# Altium schematic sheet AllInOne.SchDoc
size A4
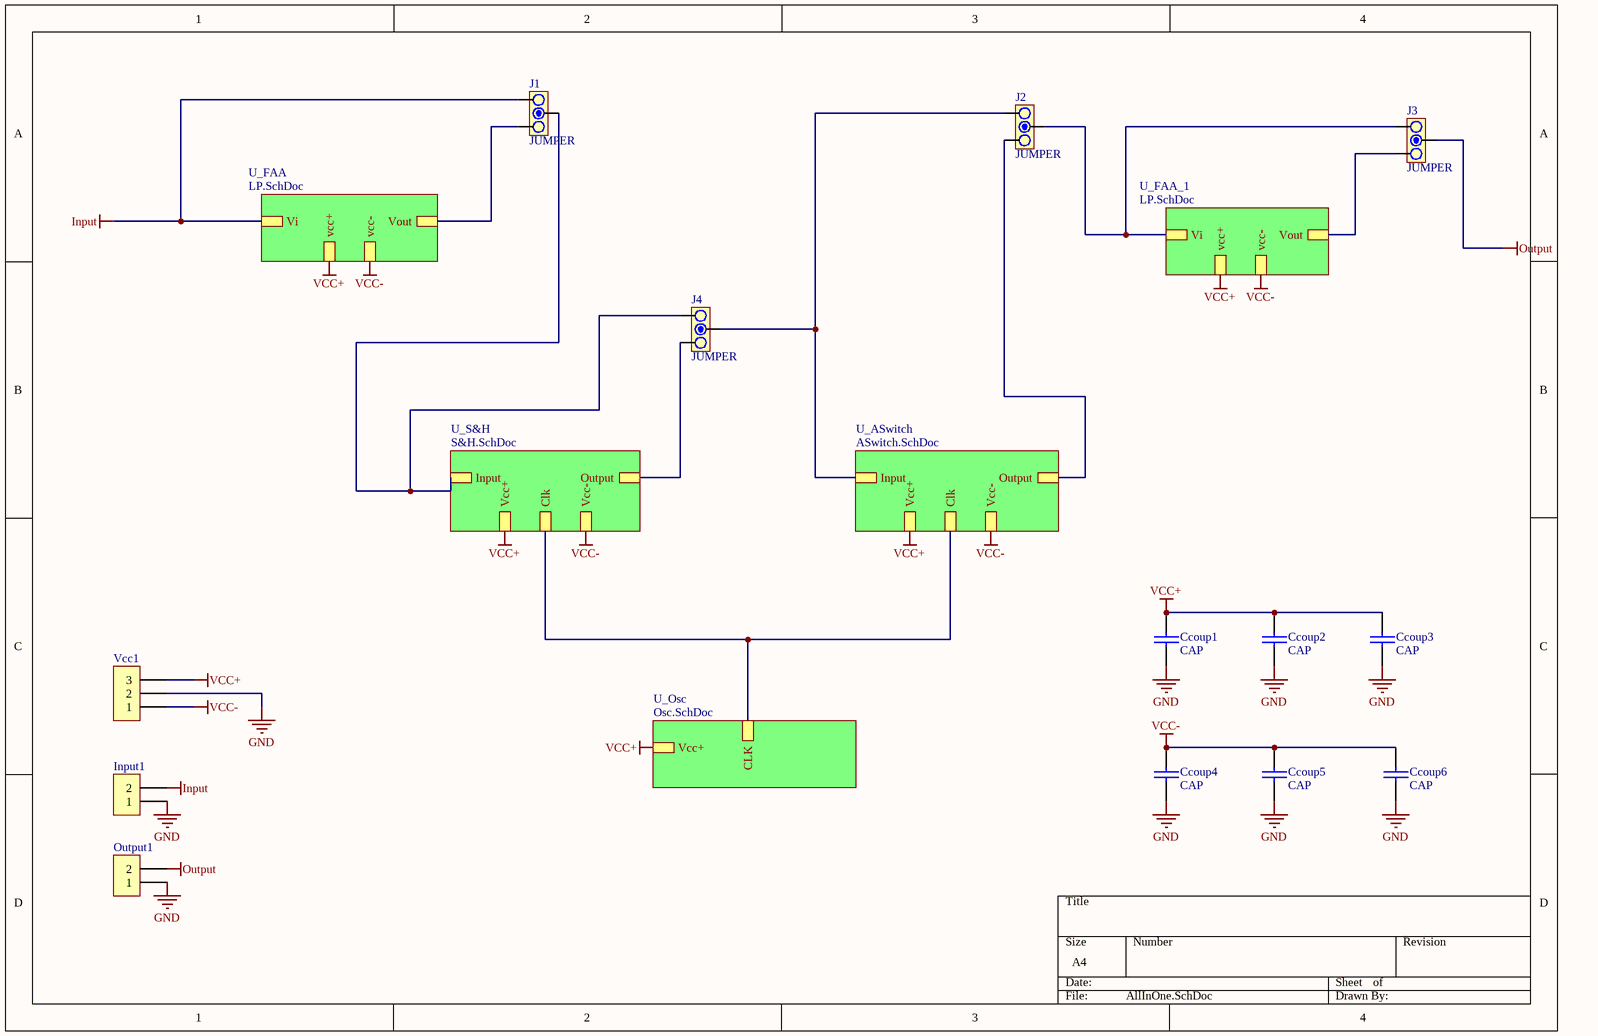
[diagram p0: AllInOne.SchDoc]

## Parts
Ccoup1  CAP  [0805]
Ccoup2  CAP  [0805]
Ccoup3  CAP  [0805]
Ccoup4  CAP  [0805]
Ccoup5  CAP  [0805]
Ccoup6  CAP  [0805]
Input1  BORNERA 2  [BORNERA2]  (value not drawn)
J1  JUMPER  [JUMPER3]
J2  JUMPER  [JUMPER3]
J3  JUMPER  [JUMPER3]
J4  JUMPER  [JUMPER3]
Output1  BORNERA 2  [BORNERA2]  (value not drawn)
Vcc1  BORNERA 3  [BORNERA3]  (value not drawn)

## Sub-sheets
U_ASwitch = ASwitch.SchDoc: Input, Output, Vcc+, Vcc-, Clk
U_FAA = LP.SchDoc: vcc+, vcc-, Vi, Vout
U_FAA_1 = LP.SchDoc: vcc+, vcc-, Vi, Vout
U_Osc = Osc.SchDoc: CLK, Vcc+
U_S&H = S&H.SchDoc: Output, Input, Vcc+, Clk, Vcc-

## Nets
GND: Ccoup1.2 Ccoup2.2 Ccoup3.2 Ccoup4.2 Ccoup5.2 Ccoup6.2 Input1.1 Output1.1 Vcc1.2
Input: Input1.2 J1.3 ; sheet U_FAA/Vi
Output: J3.2 Output1.2
VCC+: Ccoup1.1 Ccoup2.1 Ccoup3.1 Vcc1.3 ; sheet U_FAA/vcc+, sheet U_FAA_1/vcc+, sheet U_S&H/Vcc+, sheet U_ASwitch/Vcc+, sheet U_Osc/Vcc+
VCC-: Ccoup4.1 Ccoup5.1 Ccoup6.1 Vcc1.1 ; sheet U_FAA/vcc-, sheet U_FAA_1/vcc-, sheet U_S&H/Vcc-, sheet U_ASwitch/Vcc-
NetJ1_1: J1.1 ; sheet U_FAA/Vout
NetJ1_2: J1.2 J4.3 ; sheet U_S&H/Input
NetJ2_1: J2.1 ; sheet U_ASwitch/Output
NetJ2_2: J2.2 J3.3 ; sheet U_FAA_1/Vi
NetJ2_3: J2.3 J4.2 ; sheet U_ASwitch/Input
NetJ3_1: J3.1 ; sheet U_FAA_1/Vout
NetJ4_1: J4.1 ; sheet U_S&H/Output
(unnamed): sheet U_S&H/Clk, sheet U_ASwitch/Clk, sheet U_Osc/CLK

## Library data of the parts
J1-J4 = JUMPER3